# Altium schematic sheet VSense.SchDoc: Voltage Sense
size 431 x 279 mm; DocumentNumber: 4; SheetNumber: 4; SheetTotal: 18; ENG_APP_DATE: --/--/--; DSN_APP_DATE: --/--/--; CHK_APP_DATE: --/--/--
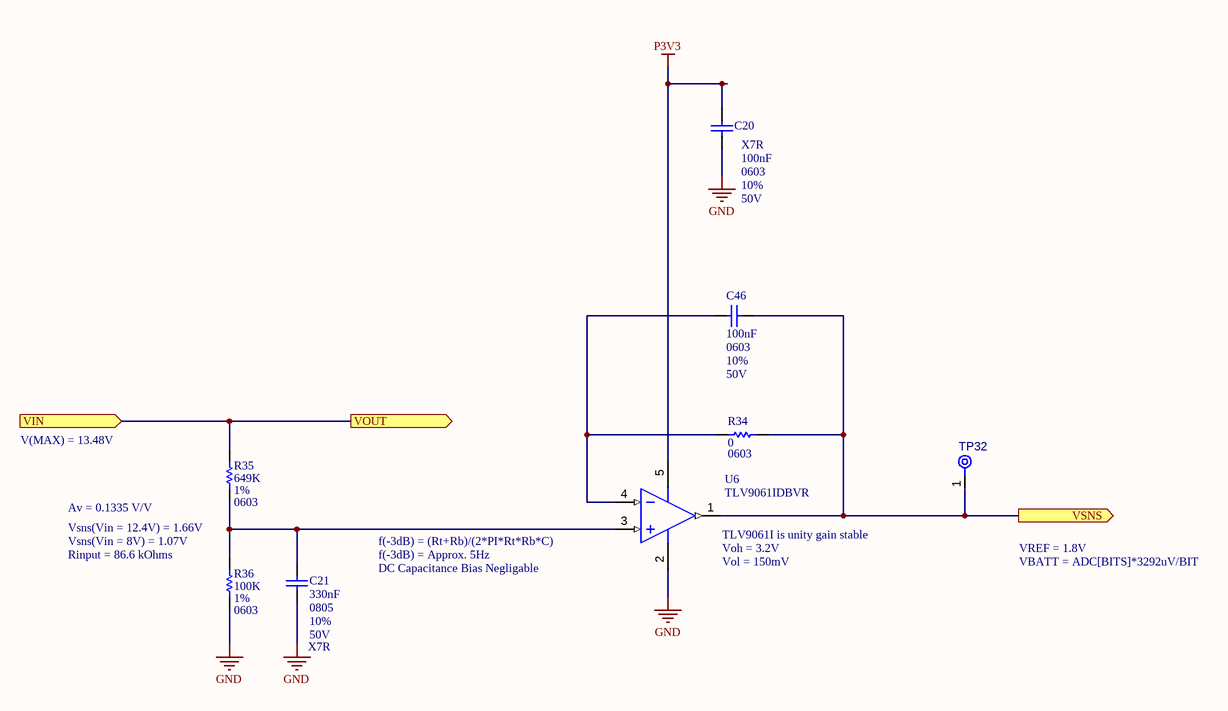
[diagram p0: VSense.SchDoc]

## Parts
C20  value 100nF  Dielectric: X7R  Case/Package: 0603  Tolerance: 10%  Voltage Rating: 50V  [CAPC1608X90X40ML10T20]  (hidden comment: Capacitor 100nF +/- 10%, 50V, X7R, 0603)
C21  value 330nF  Dielectric: X7R  Case/Package: 0805  Tolerance: 10%  Voltage Rating: 50V  [CAPC2013X95X50ML10T25]  (hidden comment: Capacitor 330nF 10%, 50V, X7R, 0805)
C46  value 100nF  Case/Package: 0603  Tolerance: 10%  Voltage Rating: 50V  [CAPC1608X90X40ML10T20]  (hidden comment: Capacitor 100nF +/- 10%, 50V, X7R, 0603)
R34  value 0  Case/Package: 0603  [RESC1608X55X25ML10T15]  (hidden comment: Resistor 0R +/- 5% 0603 100 mW)
R35  value 649K  Tolerance: 1%  Case/Package: 0603  [RESC1609X50X30ML08T20]  (hidden comment: Resistor 649K +/-1% 0603 100 mW)
R36  value 100K  Case/Package: 0603  Tolerance: 1%  [RESC1609X50X30ML08T20]  (hidden comment: Resistor 100K +/-1% 0603 100 mW)
TP32  TPAD6R-CIRCLED  [TP06R - Circled]  (value not drawn)  (no BOM)
U6  TLV9061IDBVR  [DBV0005A_L]

## Ports
VIN (in), VOUT (out), VSNS (out)

## Nets
GND: C20.1 C21.1 R36.2 U6.2(GND)
P3V3: C20.2 U6.5(VDD)
VIN: R35.1 ; port VIN, port VOUT
VSNS: C46.1 R34.2 TP32.1(TP) U6.1(OUT) ; port VSNS
NetC21_2: C21.2 R35.2 R36.1 U6.3(IN+)
NetC46_2: C46.2 R34.1 U6.4(IN-)

## Notes on the sheet
- V(MAX) = 13.48V
- Av = 0.1335 V/V
- Vsns(Vin = 12.4V) = 1.66V
- Vsns(Vin = 8V) = 1.07V
- f(-3dB) = (Rt+Rb)/(2*PI*Rt*Rb*C)
- (near U6) TLV9061I is unity gain stable
- (near R36) Rinput = 86.6 kOhms
- f(-3dB) = Approx. 5Hz
- DC Capacitance Bias Negligable
- (near U6) Voh = 3.2V
- (near U6) Vol = 150mV
- VREF = 1.8V
- VBATT = ADC[BITS]*3292uV/BIT
- THIS DOCUMENT AND THE DATA DISCLOSED HEREIN OR HEREWITH IS THE PROPERTY OF APPLIED PHYSICS LAB - UNIVERSITY OF WASHINGTON.
- PROJECT
- TITLE
- FILE NAME
- SIZE
- B
- CAGE CODE
- DWG NO.
- SHEET
- OF
- REV

## Library data of the parts
C20 C46 = CMP-001-00206-10: Chip Capacitor, 100nF, +/- 10%, 50 V, X7R 0603 (1608 Metric); Capacitor Type: Ceramic; Pins: 2; RoHS Compliant: True; Max Operating Temperature: 125°C; Capacitance: 100nF; Min Operating Temperature: -55°C; Decade: 100nF; Mount: Surface Mount
  C46: Dielectric: X7R
C21 = CMP-001-00138-11: Chip Capacitor, 330nF, 10%, 50 V, X7R 0805 (2012 Metric); Capacitor Type: Ceramic; Decade: 100nF; Pins: 2; RoHS Compliant: True; Max Operating Temperature: 125°C; Capacitance: 330nF; Min Operating Temperature: -55°C; Mount: Surface Mount
R34 = CMP-009-00006-7: Chip Resistor, 0 Ohm, 0.1 W, -55 to 155 degC, 0603 (1608 Metric); Voltage Rating: 50V; Power: 100mW; Pins: 2; RoHS Compliant: True; Min Operating Temperature: -55°C; Max Operating Temperature: 155°C; Tolerance: 5%; Mount: Surface Mount; Decade: 0
R35 = CMP-009-01047-2: Chip Resistor, 649k Ohm, +/- 1%, 0.1 W, -55 to 155 degC, 0603 (1608 Metric); Voltage Rating: 75V; Decade: 100k; Power: 100mW; RoHS Compliant: Yes; Pins: 2; Min Operating Temperature: -55°C; Max Operating Temperature: 155°C; Mount: Surface Mount
R36 = CMP-009-01065-2: Chip Resistor, 100k Ohm, +/- 1%, 0.1 W, -55 to 155 degC, 0603 (1608 Metric); Voltage Rating: 75V; Power: 100mW; Min Operating Temperature: -55°C; Max Operating Temperature: 155°C; RoHS Compliant: Yes; Pins: 2; Decade: 100k; Mount: Surface Mount
TP32 = CMP-00028-00014-3: 0.6mm round with a silkscreen circle.; Pins: 1
U6 = CMP-014-00040-1: Single, 5.5-V, 10-MHz, RRIO operational amplifier for cost-optimized applications 5-SOT-23 -40 to 125; Manufacturer: Texas Instruments; Bandwidth: 9MHz; Number of Channels: 1; Supply Current: 1mA; Input Bias Current: 0.5pA; Min Supply Voltage: 1.8V; Output Current: 28mA; Gain Bandwidth Product: 10MHz; Max Supply Voltage: 5.5V; Slew Rate: 6.5V/µs; Input Offset Voltage (Vos): 300uV; Max Operating Temperature: 125°C; Case/Package: SOT-23-5; Mount: Surface Mount